# Altium project Chronos.PrjPcb (part 1 of 3)
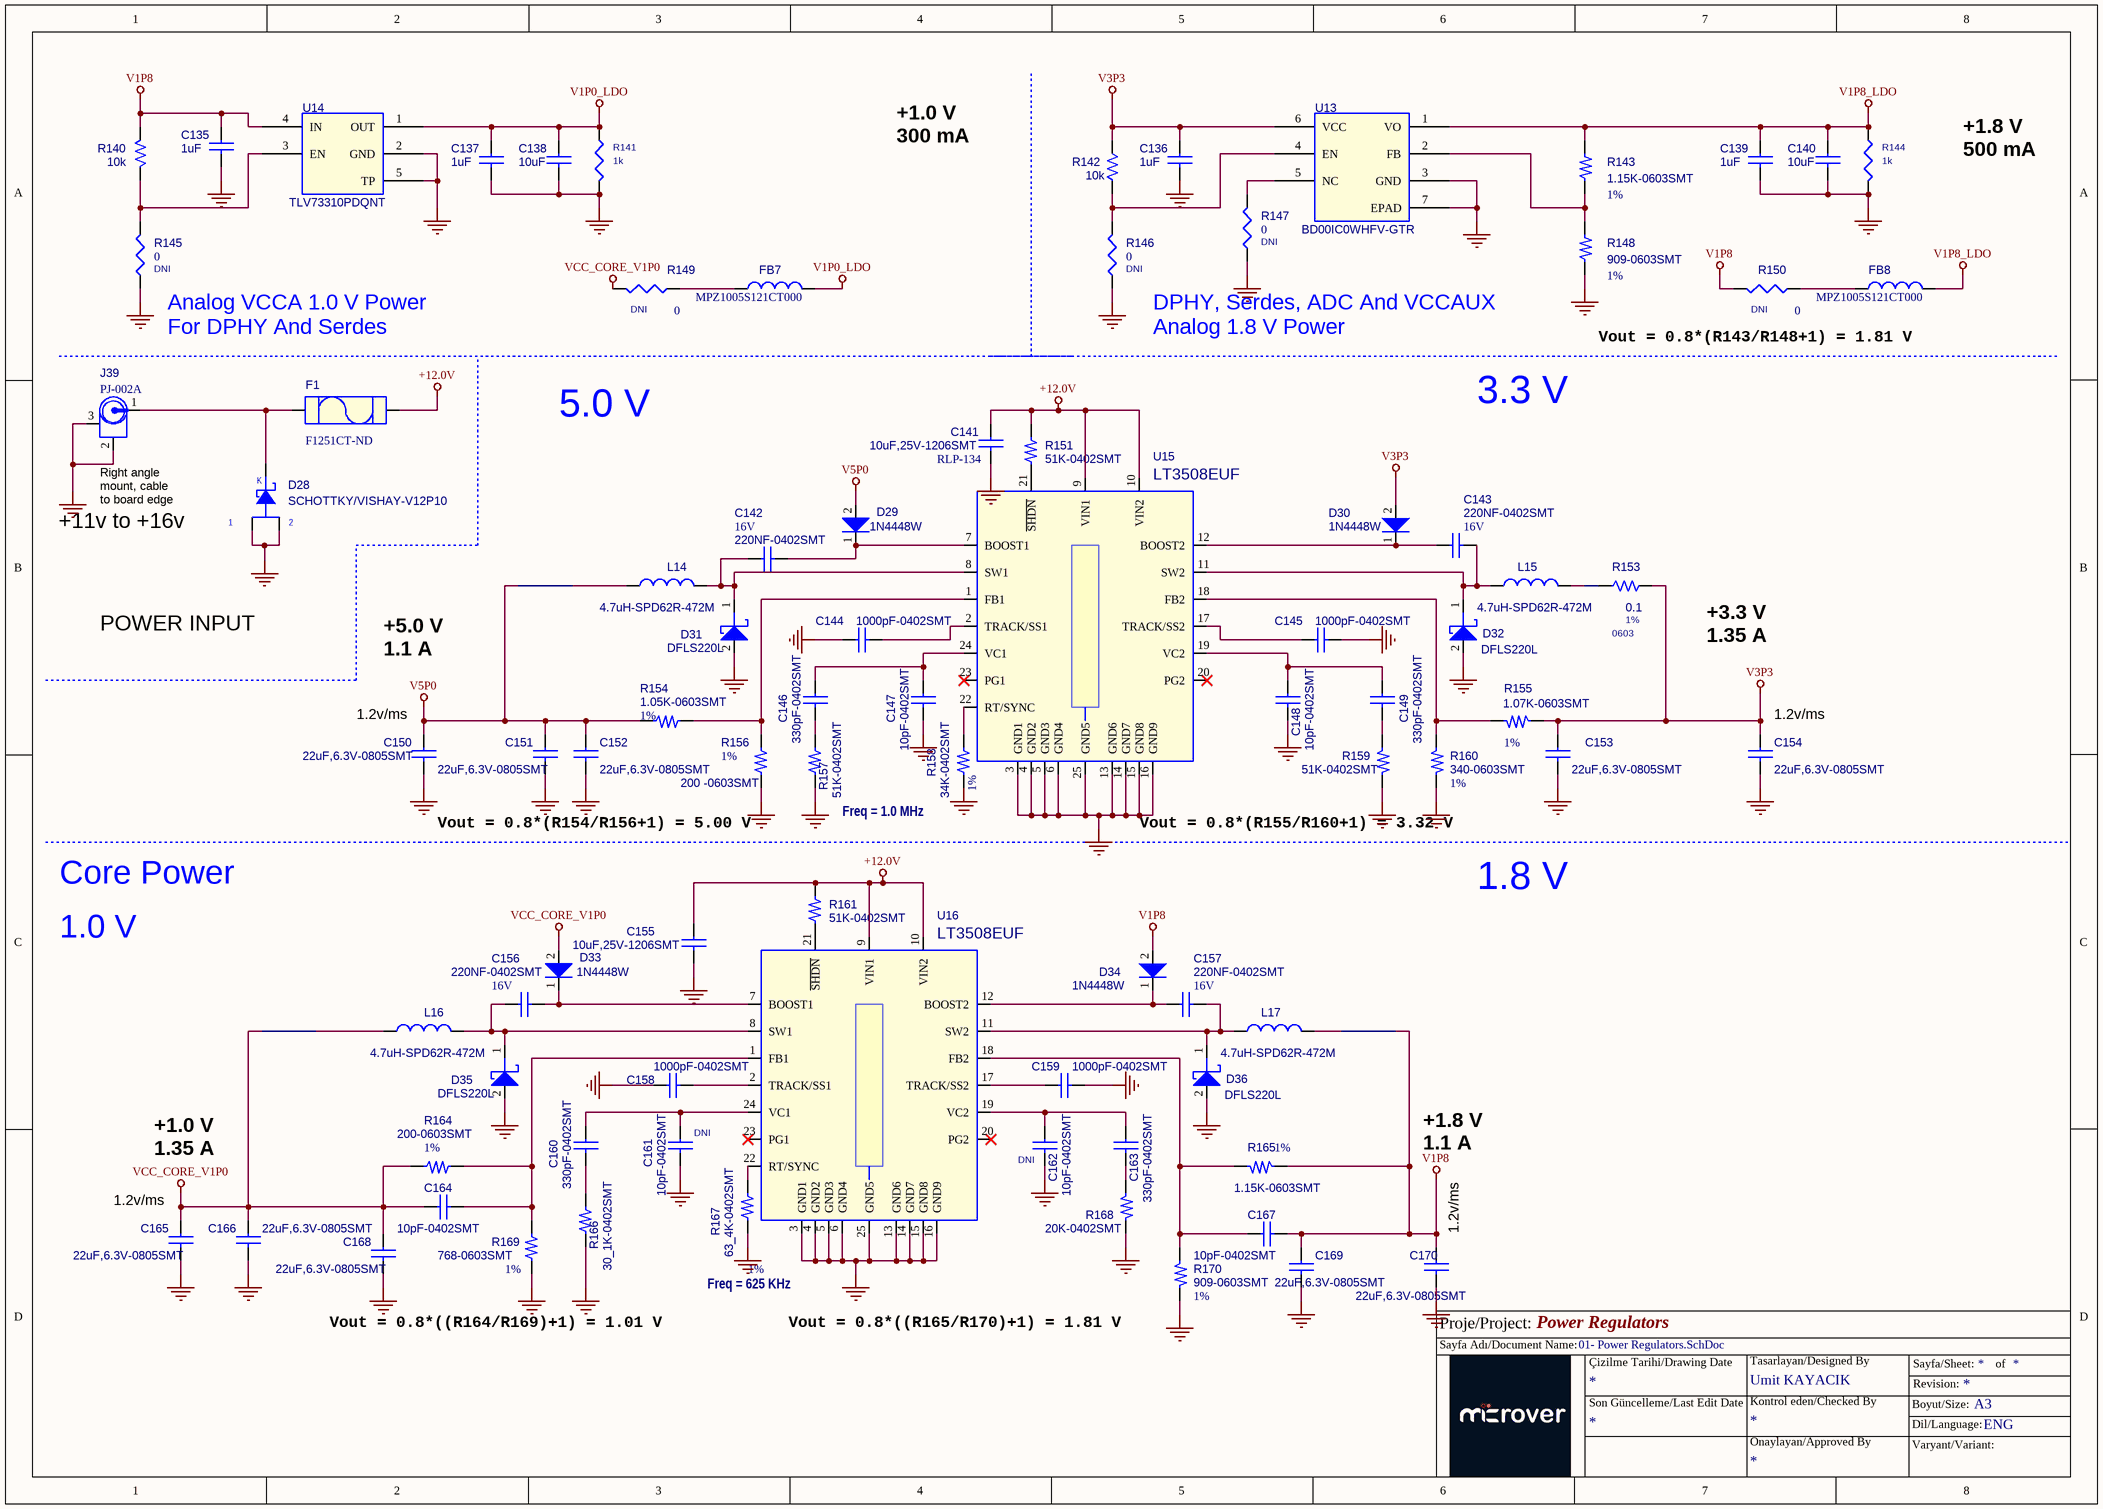
[diagram p0: 01- Power Regulators.SchDoc]
12 sheets, 413 parts. Net scope: global (net labels, ports and power ports of the same name join across sheets).
Board file: Chronos.PcbDoc
Sheets:
  01- Power Regulators.SchDoc
  02 - Power CSI and Bank Power.SchDoc
  03- Power Decoupling.SchDoc
  04 - Camera Interface.SchDoc
  05 - Camera Interface 2.SchDoc
  06 - Soft_DPHY.SchDoc
  07 - USB Interface.SchDoc
  08- Bank2_6_7.SchDoc
  09- I2C, LEDs And Push Button.SchDoc
  10 - Configuration And ADC.SchDoc
  11- IMU.SchDoc
  12 - JETSON_CON.SchDoc

## Sheet 01- Power Regulators.SchDoc: Power Regulators
size A3; Page Number: 1; Page Size: B; Page Count: 12; Board Rev: B; Project Name: CrossLink-NX Evaluation Board; RevCode: 1.0; Doc: 305-PD-19-0819; DsnPath: C:\Users\HAltinkilit\Downloads\Crosslink-NX-Design-Files\CrossLink-NX-Eval-Brd-Schematic-RevB-191122.DSN; SchematicName: SCHEMATIC1; PageName: 13 - Power Regulators; PageSize: B; TopSchematic: True

### Parts
C135  1uF  [C0603]
C136  1uF  [C0603]
C137  1uF  [C0603]
C138  10uF  [C0603]
C139  1uF  [C0603]
C140  10uF  [C0603]
C141  10uF,25V-1206SMT  [RLP-134]
C142  220NF-0402SMT  COMPFIXED: 16V  [RLP-130-A]
C143  220NF-0402SMT  COMPFIXED: 16V  [RLP-130-A]
C144  1000pF-0402SMT  [RLP-130-A]
C145  1000pF-0402SMT  [RLP-130-A]
C146  330pF-0402SMT  [RLP-130-A]
C147  10pF-0402SMT  [RLP-130-A]
C148  10pF-0402SMT  [RLP-130-A]
C149  330pF-0402SMT  [RLP-130-A]
C150  22uF,6.3V-0805SMT  [RLP-133]
C151  22uF,6.3V-0805SMT  [RLP-133]
C152  22uF,6.3V-0805SMT  [RLP-133]
C153  22uF,6.3V-0805SMT  [RLP-133]
C154  22uF,6.3V-0805SMT  [RLP-133]
C155  10uF,25V-1206SMT  [RLP-134]
C156  220NF-0402SMT  COMPFIXED: 16V  [RLP-130-A]
C157  220NF-0402SMT  COMPFIXED: 16V  [RLP-130-A]
C158  1000pF-0402SMT  [RLP-130-A]
C159  1000pF-0402SMT  [RLP-130-A]
C160  330pF-0402SMT  [RLP-130-A]
C161  10pF-0402SMT  Populate: DNI  [RLP-130-A]
C162  10pF-0402SMT  Populate: DNI  [RLP-130-A]
C163  330pF-0402SMT  [RLP-130-A]
C164  10pF-0402SMT  [RLP-130-A]
C165  22uF,6.3V-0805SMT  [RLP-133]
C166  22uF,6.3V-0805SMT  [RLP-133]
C167  10pF-0402SMT  [RLP-130-A]
C168  22uF,6.3V-0805SMT  [RLP-133]
C169  22uF,6.3V-0805SMT  [RLP-133]
C170  22uF,6.3V-0805SMT  [RLP-133]
D28  SCHOTTKY/VISHAY-V12P10  [V12P10]
D29  1N4448W  [1N4448W]
D30  1N4448W  [1N4448W]
D31  DFLS220L  [DFLS220L]
D32  DFLS220L  [DFLS220L]
D33  1N4448W  [1N4448W]
D34  1N4448W  [1N4448W]
D35  DFLS220L  [DFLS220L]
D36  DFLS220L  [DFLS220L]
F1  F1251CT-ND  [0154010]
FB7  MPZ1005S121CT000  [FB0402]
FB8  MPZ1005S121CT000  [FB0402]
J39  PJ-002A  [pj_002a_3p]
L14  4.7uH-SPD62R-472M  [SPD62R]
L15  4.7uH-SPD62R-472M  [SPD62R]
L16  4.7uH-SPD62R-472M  [SPD62R]
L17  4.7uH-SPD62R-472M  [SPD62R]
R140  10k  [R0402]
R141  1k  [R0402]
R142  10k  [R0402]
R143  1.15K-0603SMT  COMPFIXED: 1%  [RLP-101]
R144  1k  [R0402]
R145  0  Assy: DNI  [R0402]
R146  0  Assy: DNI  [R0603]
R147  0  Assy: DNI  [R0603]
R148  909-0603SMT  COMPFIXED: 1%  [RLP-101]
R149  0  Assy: DNI  [R0603]
R150  0  Assy: DNI  [R0603]
R151  51K-0402SMT  [RLP-100]
R153  0.1  Tollerance: 1%  [0603]
R154  1.05K-0603SMT  COMPFIXED: 1%  [RLP-101]
R155  1.07K-0603SMT  COMPFIXED: 1%  [RLP-101]
R156  200 -0603SMT  COMPFIXED: 1%  [RLP-101]
R157  51K-0402SMT  [RLP-100]
R158  34K-0402SMT  COMPGROUP: Freq = 1.0 MHz  COMPFIXED: 1%  [RLP-100]
R159  51K-0402SMT  [RLP-100]
R160  340-0603SMT  COMPFIXED: 1%  [RLP-101]
R161  51K-0402SMT  [RLP-100]
R164  200-0603SMT  COMPFIXED: 1%  [RLP-101]
R165  1.15K-0603SMT  COMPFIXED: 1%  [RLP-101]
R166  30_1K-0402SMT  [RLP-100]
R167  63_4K-0402SMT  COMPGROUP: Freq = 625 KHz  COMPFIXED: 1%  [RLP-100]
R168  20K-0402SMT  [RLP-100]
R169  768-0603SMT  COMPFIXED: 1%  [RLP-101]
R170  909-0603SMT  COMPFIXED: 1%  [RLP-101]
U13  BD00IC0WHFV-GTR  [6HVSOF_BD00IC0WHFV]
U14  TLV73310PDQNT  [4X2SON]
U15  LT3508EUF  [LT3508EUF]
U16  LT3508EUF  [LT3508EUF]

### Nets
+12.0V: C141.1 C155.1 F1.2 R151.1 R161.1 U15.9(VIN1) U15.10(VIN2) U16.9(VIN1) U16.10(VIN2)
GND: C135.2 C136.2 C137.2 C138.2 C139.2 C140.2 C141.2 C144.1 C145.2 C147.2 C148.2 C150.2 C151.2 C152.2 C153.2 C154.2 C155.2 C158.1 C159.2 C161.2 C162.2 C165.2 C166.2 C168.2 C169.2 C170.2 D28.1(Anode1) D28.2(Anode2) D31.2 D32.2 D35.2 D36.2 J39.2(GND) J39.3(GND) R141.2 R144.2 R145.2 R146.2 R147.2 R148.1 R156.2 R157.2 R158.2 R159.2 R160.2 R166.2 R167.2 R168.2 R169.2 R170.2 U13.3(GND) U13.7(EPAD) U14.2(GND) U14.5(TP) U15.3(GND1) U15.4(GND2) U15.5(GND3) U15.6(GND4) U15.13(GND6) U15.14(GND7) U15.15(GND8) U15.16(GND9) U15.25(GND5) U16.3(GND1) U16.4(GND2) U16.5(GND3) U16.6(GND4) U16.13(GND6) U16.14(GND7) U16.15(GND8) U16.16(GND9) U16.25(GND5)
V1P0_LDO: C137.1 C138.1 FB7.2 R141.1 U14.1(OUT)
V1P8: C135.1 C167.2 C169.1 C170.1 D34.2 L17.1 R140.2 R150.2 R165.1 U14.4(IN)
V1P8_LDO: C139.1 C140.1 FB8.2 R143.2 R144.1 U13.1(VO)
V3P3: C136.1 C153.1 C154.1 D30.2 R142.2 R153.2 R155.1 U13.6(VCC)
V5P0: C150.1 C151.1 C152.1 D29.2 L14.1 R154.1
VCC_CORE_V1P0: C164.1 C165.1 C166.1 C168.1 D33.2 L16.1 R149.2 R164.1
NetC142_1: C142.1 D31.1 L14.2 U15.8(SW1)
NetC142_2: C142.2 D29.1 U15.7(BOOST1)
NetC143_1: C143.1 D30.1 U15.12(BOOST2)
NetC143_2: C143.2 D32.1 L15.2 U15.11(SW2)
NetC144_2: C144.2 U15.2(TRACK/SS1)
NetC145_1: C145.1 U15.17(TRACK/SS2)
NetC146_1: C146.1 C147.1 U15.24(VC1)
NetC146_2: C146.2 R157.1
NetC148_1: C148.1 C149.1 U15.19(VC2)
NetC149_2: C149.2 R159.1
NetC156_1: C156.1 D35.1 L16.2 U16.8(SW1)
NetC156_2: C156.2 D33.1 U16.7(BOOST1)
NetC157_1: C157.1 D34.1 U16.12(BOOST2)
NetC157_2: C157.2 D36.1 L17.2 U16.11(SW2)
NetC158_2: C158.2 U16.2(TRACK/SS1)
NetC159_1: C159.1 U16.17(TRACK/SS2)
NetC160_1: C160.1 C161.1 U16.24(VC1)
NetC160_2: C160.2 R166.1
NetC162_1: C162.1 C163.1 U16.19(VC2)
NetC163_2: C163.2 R168.1
NetC164_2: C164.2 R164.2 R169.1 U16.1(FB1)
NetC167_1: C167.1 R165.2 R170.1 U16.18(FB2)
NetD28_3: D28.3(K) F1.1 J39.1(+5V)
NetFB7_1: FB7.1 R149.1
NetFB8_1: FB8.1 R150.1
NetL15_1: L15.1 R153.1
NetR140_1: R140.1 R145.1 U14.3(EN)
NetR142_1: R142.1 R146.1 U13.4(EN)
NetR143_1: R143.1 R148.2 U13.2(FB)
NetR147_1: R147.1 U13.5(NC)
NetR151_2: R151.2 U15.21(~{SHDN})
NetR154_2: R154.2 R156.1 U15.1(FB1)
NetR155_2: R155.2 R160.1 U15.18(FB2)
NetR158_1: R158.1 U15.22(RT/SYNC)
NetR161_2: R161.2 U16.21(~{SHDN})
NetR167_1: R167.1 U16.22(RT/SYNC)

Not connected (* = marked no-connect by the designer): U15 20(PG2)* 23(PG1)*; U16 20(PG2)* 23(PG1)*

### Notes on the sheet
- +1.0 V
  300 mA
- +1.8 V
  500 mA
- (near R145) Analog VCCA 1.0 V Power
  For DPHY And Serdes
- DPHY, Serdes, ADC And VCCAUX
  Analog 1.8 V Power
- Vout = 0.8*(R143/R148+1) = 1.81 V
- 5.0 V
- 3.3 V
- (near J39) Right angle
  mount, cable
  to board edge
- (near D28) K
- +11v to +16v
- (near D28) 1
- (near D28) 2
- POWER INPUT
- +5.0 V
  1.1 A
- +3.3 V
  1.35 A
- (near C150) 1.2v/ms
- (near C154) 1.2v/ms
- Vout = 0.8*(R154/R156+1) = 5.00 V
- Vout = 0.8*(R155/R160+1) = 3.32 V
- Core Power
- 1.8 V
- 1.0 V
- +1.0 V
  1.35 A
- +1.8 V
  1.1 A
- (near C165) 1.2v/ms
- (near C170) 1.2v/ms
- Vout = 0.8*((R164/R169)+1) = 1.01 V
- Vout = 0.8*((R165/R170)+1) = 1.81 V
- Proje/Project:
- Sayfa Adı/Document Name:
- Çizilme Tarihi/Drawing Date
- Umit KAYACIK
- Tasarlayan/Designed By
- Sayfa/Sheet:
- Revision:
- of
- Son Güncelleme/Last Edit Date
- Kontrol eden/Checked By
- Onaylayan/Approved By
- Boyut/Size:
- Varyant/Variant:
- Dil/Language:
- A3
- ENG

### Library data of the parts
C135 = CAP NP: CAP CER 10UF 10V 20% X6S 0603; Part Reference: C135; Manufacturer Part Number: CL10X106MP8NRNC; Manufacturer: Samsung; Value: 1uF; MFG P/N: CL10X106MP8NRNC; Man. Part #: CL10X106MP8NRNC; MFG: Samsung; Assy: -; PCB Footprint: C0603
C136 = CAP NP: CAP CER 10UF 10V 20% X6S 0603; Part Reference: C136; Manufacturer Part Number: CL10X106MP8NRNC; Manufacturer: Samsung; Value: 1uF; MFG P/N: CL10X106MP8NRNC; Man. Part #: CL10X106MP8NRNC; MFG: Samsung; Assy: -; PCB Footprint: C0603
C137 = CAP NP: CAP CER 10UF 10V 20% X6S 0603; Part Reference: C137; Manufacturer Part Number: CL10X106MP8NRNC; Manufacturer: Samsung; Value: 1uF; Assy: -; MFG P/N: CL10X106MP8NRNC; Man. Part #: CL10X106MP8NRNC; MFG: Samsung; PCB Footprint: C0603
C138 = CAP NP: CAP CER 10UF 10V 20% X6S 0603; Part Reference: C138; Man. Part #: CL10X106MP8NRNC; MFG: Samsung; Value: 10uF; Assy: -; Manufacturer: Samsung; MFG P/N: CL10X106MP8NRNC; Manufacturer Part Number: CL10X106MP8NRNC; PCB Footprint: C0603
C139 = CAP NP: CAP CER 10UF 10V 20% X6S 0603; Part Reference: C139; Man. Part #: CL10X106MP8NRNC; MFG: Samsung; Value: 1uF; Assy: -; Manufacturer: Samsung; MFG P/N: CL10X106MP8NRNC; Manufacturer Part Number: CL10X106MP8NRNC; PCB Footprint: C0603
C140 = CAP NP: CAP CER 10UF 10V 20% X6S 0603; Part Reference: C140; Man. Part #: CL10X106MP8NRNC; MFG: Samsung; Value: 10uF; Assy: -; Manufacturer: Samsung; MFG P/N: CL10X106MP8NRNC; Manufacturer Part Number: CL10X106MP8NRNC; PCB Footprint: C0603
C141 = CAP-NP: Part Reference: C141; Value: 10uF,25V-1206SMT; Assy: -; PCB Footprint: RLP-134
C142 = CAP-NP: Part Reference: C142; Value: 220NF-0402SMT; Assy: -; PCB Footprint: RLP-130-A
C143 = CAP-NP: Part Reference: C143; Value: 220NF-0402SMT; Assy: -; PCB Footprint: RLP-130-A
C144 = CAP-NP: Part Reference: C144; Value: 1000pF-0402SMT; Assy: -; PCB Footprint: RLP-130-A
C145 = CAP-NP: Part Reference: C145; Value: 1000pF-0402SMT; Assy: -; PCB Footprint: RLP-130-A
C146 = CAP-NP: Part Reference: C146; Value: 330pF-0402SMT; Assy: -; PCB Footprint: RLP-130-A
C147 = CAP-NP: Part Reference: C147; Value: 10pF-0402SMT; Assy: -; PCB Footprint: RLP-130-A
C148 = CAP-NP: Part Reference: C148; Value: 10pF-0402SMT; Assy: -; PCB Footprint: RLP-130-A
C149 = CAP-NP: Part Reference: C149; Value: 330pF-0402SMT; Assy: -; PCB Footprint: RLP-130-A
C150 = CAP-NP: CAP CER 22UF 10V X5R 0805; Part Reference: C150; Manufacturer: Samsung; Manufacturer Part Number: CL21A226KPCLRNC; Value: 22uF,6.3V-0805SMT; Assy: -; PCB Footprint: RLP-133
C151 = CAP-NP: CAP CER 22UF 10V X5R 0805; Part Reference: C151; Manufacturer: Samsung; Manufacturer Part Number: CL21A226KPCLRNC; Value: 22uF,6.3V-0805SMT; Assy: -; PCB Footprint: RLP-133
C152 = CAP-NP: CAP CER 22UF 10V X5R 0805; Part Reference: C152; Manufacturer: Samsung; Manufacturer Part Number: CL21A226KPCLRNC; Value: 22uF,6.3V-0805SMT; Assy: -; PCB Footprint: RLP-133
C153 = CAP-NP: CAP CER 22UF 10V X5R 0805; Part Reference: C153; Manufacturer Part Number: CL21A226KPCLRNC; Manufacturer: Samsung; Value: 22uF,6.3V-0805SMT; Assy: -; PCB Footprint: RLP-133
C154 = CAP-NP: CAP CER 22UF 10V X5R 0805; Part Reference: C154; Manufacturer Part Number: CL21A226KPCLRNC; Manufacturer: Samsung; Value: 22uF,6.3V-0805SMT; Assy: -; PCB Footprint: RLP-133
C155 = CAP-NP: Part Reference: C155; Value: 10uF,25V-1206SMT; Assy: -; PCB Footprint: RLP-134
C156 = CAP-NP: Part Reference: C156; Value: 220NF-0402SMT; Assy: -; PCB Footprint: RLP-130-A
C157 = CAP-NP: Part Reference: C157; Value: 220NF-0402SMT; Assy: -; PCB Footprint: RLP-130-A
C158 = CAP-NP: Part Reference: C158; Value: 1000pF-0402SMT; Assy: -; PCB Footprint: RLP-130-A
C159 = CAP-NP: Part Reference: C159; Value: 1000pF-0402SMT; Assy: -; PCB Footprint: RLP-130-A
C160 = CAP-NP: Part Reference: C160; Value: 330pF-0402SMT; Assy: -; PCB Footprint: RLP-130-A
C161 = CAP-NP: Part Reference: C161; ASSY: DNI; Value: 10pF-0402SMT; PCB Footprint: RLP-130-A
C162 = CAP-NP: Part Reference: C162; ASSY: DNI; Value: 10pF-0402SMT; PCB Footprint: RLP-130-A
C163 = CAP-NP: Part Reference: C163; Value: 330pF-0402SMT; Assy: -; PCB Footprint: RLP-130-A
C164 = CAP-NP: Part Reference: C164; Value: 10pF-0402SMT; Assy: -; PCB Footprint: RLP-130-A
C165 = CAP-NP: CAP CER 22UF 10V X5R 0805; Part Reference: C165; Manufacturer Part Number: CL21A226KPCLRNC; Manufacturer: Samsung; Value: 22uF,6.3V-0805SMT; Assy: -; PCB Footprint: RLP-133
C166 = CAP-NP: CAP CER 22UF 10V X5R 0805; Part Reference: C166; Manufacturer: Samsung; Manufacturer Part Number: CL21A226KPCLRNC; Value: 22uF,6.3V-0805SMT; Assy: -; PCB Footprint: RLP-133
C167 = CAP-NP: Part Reference: C167; Value: 10pF-0402SMT; Assy: -; PCB Footprint: RLP-130-A
C168 = CAP-NP: CAP CER 22UF 10V X5R 0805; Part Reference: C168; Manufacturer: Samsung; Manufacturer Part Number: CL21A226KPCLRNC; Value: 22uF,6.3V-0805SMT; Assy: -; PCB Footprint: RLP-133
C169 = CAP-NP: CAP CER 22UF 10V X5R 0805; Part Reference: C169; Manufacturer Part Number: CL21A226KPCLRNC; Manufacturer: Samsung; Value: 22uF,6.3V-0805SMT; Assy: -; PCB Footprint: RLP-133
C170 = CAP-NP: CAP CER 22UF 10V X5R 0805; Part Reference: C170; Manufacturer: Samsung; Manufacturer Part Number: CL21A226KPCLRNC; Value: 22uF,6.3V-0805SMT; Assy: -; PCB Footprint: RLP-133
D28 = DIODE SCHOTTKY21: Part Reference: D28; Value: SCHOTTKY/VISHAY-V12P10; Assy: -; PCB Footprint: V12P10
D29 = DIODE_0: Part Reference: D29; Value: 1N4448W; Assy: -; PCB Footprint: 1N4448W
D30 = DIODE_0: Part Reference: D30; Value: 1N4448W; Assy: -; PCB Footprint: 1N4448W
D31 = D-SCHOTTKY_0: Part Reference: D31; Value: DFLS220L; Assy: -; PCB Footprint: DFLS220L
D32 = D-SCHOTTKY_0: Part Reference: D32; Value: DFLS220L; Assy: -; PCB Footprint: DFLS220L
D33 = DIODE_0: Part Reference: D33; Value: 1N4448W; Assy: -; PCB Footprint: 1N4448W
D34 = DIODE_0: Part Reference: D34; Value: 1N4448W; Assy: -; PCB Footprint: 1N4448W
D35 = D-SCHOTTKY_0: Part Reference: D35; Value: DFLS220L; Assy: -; PCB Footprint: DFLS220L
D36 = D-SCHOTTKY_0: Part Reference: D36; Value: DFLS220L; Assy: -; PCB Footprint: DFLS220L
F1 = SMTFUSE_0: 5A Fast-Blo SMT Socketed Fuse; Part Reference: F1; Value: F1251CT-ND; Assy: -; PCB Footprint: 0154010
FB7 = INDUCTOR_1: FERRITE BEAD 120 OHM 0402 1LN; Part Reference: FB7; Manufacturer: TDK Corporation; Value: MPZ1005S121CT000; Assy: -; PCB Footprint: FB0402; Manufacturer Part Number: MPZ1005S121CT000
FB8 = INDUCTOR_1: FERRITE BEAD 120 OHM 0402 1LN; Part Reference: FB8; Manufacturer: TDK Corporation; Value: MPZ1005S121CT000; Assy: -; PCB Footprint: FB0402; Manufacturer Part Number: MPZ1005S121CT000
J39 = 22HP037A: Male Power Jack 2.1mm; Part Reference: J39; Value: PJ-002A; Assy: -; PCB Footprint: pj_002a_3p
L14 = IND: Part Reference: L14; COMPGROUP: CDRH3D18; COMPFIXED: SUMIDA; Value: 4.7uH-SPD62R-472M; Assy: -; PCB Footprint: SPD62R
L15 = IND: Part Reference: L15; COMPFIXED: SUMIDA; COMPGROUP: CDRH3D18C; Value: 4.7uH-SPD62R-472M; Assy: -; PCB Footprint: SPD62R
L16 = IND: Part Reference: L16; COMPFIXED: SUMIDA; COMPGROUP: CDRH3D18; Value: 4.7uH-SPD62R-472M; Assy: -; PCB Footprint: SPD62R
L17 = IND: Part Reference: L17; COMPFIXED: SUMIDA; COMPGROUP: CDRH3D18C; Value: 4.7uH-SPD62R-472M; Assy: -; PCB Footprint: SPD62R
R140 = R_Dup2: RES SMD 4.7K OHM 5% 1/10W 0402; Part Reference: R140; Manufacturer Part Number: ERJ-2GEJ472X; DIST: FLAT; PSpiceTemplate: R^@REFDES %1 %2 ?TOLERANCE|R^@REFDES| @VALUE  ?TOLERANCE|\n.model R^@REFDES RES R=1 DEV=@TOLERANCE%|; VOLTAGE: RVMAX; SLOPE: RSMAX; MAX_TEMP: RTMAX; POWER: RMAX; COMPHEIGHT: 0.000; MEMORY: NO; COMPGROUP: 0; COMPROT: 180; COMPLOC: [970.000,1160.000]; COMPSIDE: TOP; FPLIST: AX/RC05,SM/R_0603; MFG: Panasonic; Value: 10k; DECOUPLER: NO; COMPKEY: NO; COMPLOCKED: NO; COMPFIXED: NO; Manufacturer: Panasonic; MFG P/N: ERJ-2GEJ472X; Assy: -; PCB Footprint: R0402
R141 = RES_1K_1W16_0402_5P: RES SMD 1K OHM 1% 1/10W 0402; Part Reference: R141; Manufacturer Part Number: ERJ-2RKF1001X; Manufacturer: Panasonic; Unit Price (USD): 0.02; Total Area(sq-mm): 0.5; Wattage: 1/16W; DIST: FLAT; MAX_TEMP: RTMAX; MFG P/N: RMCF0402JT1K00; MFG: Stackpole Electronics Inc; TC1: 0; Length(mm): 1; Width(mm): 0.5; TC2: 0; Value: 1k; Assy: -; PCB Footprint: R0402; Reference: R141
R142 = R_Dup2: RES SMD 4.7K OHM 5% 1/10W 0402; Part Reference: R142; Manufacturer: Panasonic; DIST: FLAT; PSpiceTemplate: R^@REFDES %1 %2 ?TOLERANCE|R^@REFDES| @VALUE  ?TOLERANCE|\n.model R^@REFDES RES R=1 DEV=@TOLERANCE%|; VOLTAGE: RVMAX; SLOPE: RSMAX; MAX_TEMP: RTMAX; POWER: RMAX; MFG P/N: ERJ-2GEJ472X; FPLIST: AX/RC05,SM/R_0603; COMPSIDE: TOP; COMPLOC: [970.000,1160.000]; COMPROT: 180; COMPGROUP: 0; COMPFIXED: NO; COMPHEIGHT: 0.000; Value: 10k; MFG: Panasonic; Manufacturer Part Number: ERJ-2GEJ472X; COMPLOCKED: NO; COMPKEY: NO; DECOUPLER: NO; MEMORY: NO; Assy: -; PCB Footprint: R0402
R143 = R_Dup1: Part Reference: R143; Value: 1.15K-0603SMT; Assy: -; PCB Footprint: RLP-101
R144 = RES_1K_1W16_0402_5P: RES SMD 1K OHM 1% 1/10W 0402; Part Reference: R144; Manufacturer Part Number: ERJ-2RKF1001X; Manufacturer: Panasonic; Unit Price (USD): 0.02; Total Area(sq-mm): 0.5; Wattage: 1/16W; DIST: FLAT; MAX_TEMP: RTMAX; MFG P/N: RMCF0402JT1K00; MFG: Stackpole Electronics Inc; TC1: 0; Length(mm): 1; Width(mm): 0.5; TC2: 0; Value: 1k; Assy: -; PCB Footprint: R0402; Reference: R144
R145 = 0R_0603: RES 0.0 OHM 1/10W JUMP 0402 SMD; Manufacturer: Yageo; Manufacturer Part Number: RC0603JR-070RL; Part Reference: R145; Class: Discrete; PCB Footprint: R0603; Digikey P/N: 311-0.0GRTR-ND; Value: 0
R146 = 0R_0603: RES 0.0 OHM 1/10W JUMP 0603 SMD; Manufacturer: Yageo; Manufacturer Part Number: RC0603JR-070RL; Part Reference: R146; Class: Discrete; Digikey P/N: 311-0.0GRTR-ND; Value: 0; PCB Footprint: R0603
R147 = 0R_0603: RES 0.0 OHM 1/10W JUMP 0603 SMD; Manufacturer: Yageo; Manufacturer Part Number: RC0603JR-070RL; Part Reference: R147; Class: Discrete; Digikey P/N: 311-0.0GRTR-ND; Value: 0; PCB Footprint: R0603
R148 = R_Dup1: Part Reference: R148; Value: 909-0603SMT; Assy: -; PCB Footprint: RLP-101
R149 = 0R_0603: RES 0.0 OHM 1/10W JUMP 0603 SMD; Manufacturer: Yageo; Manufacturer Part Number: RC0603JR-070RL; Part Reference: R149; Class: Discrete; Digikey P/N: 311-0.0GRTR-ND; Value: 0; PCB Footprint: R0603
R150 = 0R_0603: RES 0.0 OHM 1/10W JUMP 0603 SMD; Manufacturer: Yageo; Manufacturer Part Number: RC0603JR-070RL; Part Reference: R150; Class: Discrete; Digikey P/N: 311-0.0GRTR-ND; Value: 0; PCB Footprint: R0603
R151 = R_Dup1: Part Reference: R151; Value: 51K-0402SMT; Assy: -; PCB Footprint: RLP-100
R153 = R_Dup2: Part Reference: R153; DIST: FLAT; PSpiceTemplate: R^@REFDES %1 %2 ?TOLERANCE|R^@REFDES| @VALUE  ?TOLERANCE|\n.model R^@REFDES RES R=1 DEV=@TOLERANCE%|; VOLTAGE: RVMAX; SLOPE: RSMAX; MAX_TEMP: RTMAX; POWER: RMAX; FPLIST: AX/RC05,SM/R_0603; COMPSIDE: TOP; COMPLOC: [970.000,1160.000]; COMPROT: 180; COMPGROUP: 0; COMPFIXED: NO; COMPHEIGHT: 0.000; Value: 0.1; Assy: -; COMPLOCKED: NO; COMPKEY: NO; DECOUPLER: NO; MEMORY: NO; PCB Footprint: 0603
R154 = R_Dup1: Part Reference: R154; Value: 1.05K-0603SMT; Assy: -; PCB Footprint: RLP-101
R155 = R_Dup1: Part Reference: R155; Value: 1.07K-0603SMT; Assy: -; PCB Footprint: RLP-101
R156 = R_Dup1: Part Reference: R156; Value: 200 -0603SMT; Assy: -; PCB Footprint: RLP-101
R157 = R_Dup1: Part Reference: R157; COMPFIXED: 1%; Value: 51K-0402SMT; Assy: -; PCB Footprint: RLP-100
R158 = R_Dup1: Part Reference: R158; Value: 34K-0402SMT; Assy: -; PCB Footprint: RLP-100
R159 = R_Dup1: Part Reference: R159; COMPFIXED: 1%; Value: 51K-0402SMT; Assy: -; PCB Footprint: RLP-100
R160 = R_Dup1: Part Reference: R160; Value: 340-0603SMT; Assy: -; PCB Footprint: RLP-101
R161 = R_Dup1: Part Reference: R161; Value: 51K-0402SMT; Assy: -; PCB Footprint: RLP-100
R164 = R_Dup1: Part Reference: R164; Value: 200-0603SMT; Assy: -; PCB Footprint: RLP-101
R165 = R_Dup1: Part Reference: R165; Value: 1.15K-0603SMT; Assy: -; PCB Footprint: RLP-101
R166 = R_Dup1: Part Reference: R166; COMPFIXED: 1%; Value: 30_1K-0402SMT; Assy: -; PCB Footprint: RLP-100
R167 = R_Dup1: Part Reference: R167; Value: 63_4K-0402SMT; Assy: -; PCB Footprint: RLP-100
R168 = R_Dup1: Part Reference: R168; COMPFIXED: 1%; Value: 20K-0402SMT; Assy: -; PCB Footprint: RLP-100
R169 = R_Dup1: Part Reference: R169; Value: 768-0603SMT; Assy: -; PCB Footprint: RLP-101
R170 = R_Dup1: Part Reference: R170; Value: 909-0603SMT; Assy: -; PCB Footprint: RLP-101
U13 = BD00IC0WHFV-GTR: Part Reference: U13; Value: BD00IC0WHFV-GTR; Assy: -; PCB Footprint: 6HVSOF_BD00IC0WHFV
U14 = TLV73310PDQNT: Part Reference: U14; Value: TLV73310PDQNT; Assy: -; PCB Footprint: 4X2SON
U15 = LT3508EUF-QFN24UF-4X4_0: Part Reference: U15; UCOST: $0.00; DES: IC, LINEAR TECH, LTC1563; Value: LT3508EUF; Assy: -; PCB Footprint: LT3508EUF
U16 = LT3508EUF-QFN24UF-4X4_0: Part Reference: U16; UCOST: $0.00; DES: IC, LINEAR TECH, LTC1563; Value: LT3508EUF; Assy: -; PCB Footprint: LT3508EUF

## Sheet 02 - Power CSI and Bank Power.SchDoc: Power CSI and Banks
size A3; Page Number: 2; Page Size: B; Page Count: 12; Board Rev: B; Project Name: CrossLink-NX Evaluation Board; RevCode: 1.0; Doc: 305-PD-19-0819; DsnPath: C:\Users\HAltinkilit\Downloads\Crosslink-NX-Design-Files\CrossLink-NX-Eval-Brd-Schematic-RevB-191122.DSN; SchematicName: SCHEMATIC1; PageName: 11 - Power CSI and Bank Power; PageSize: B; TopSchematic: True
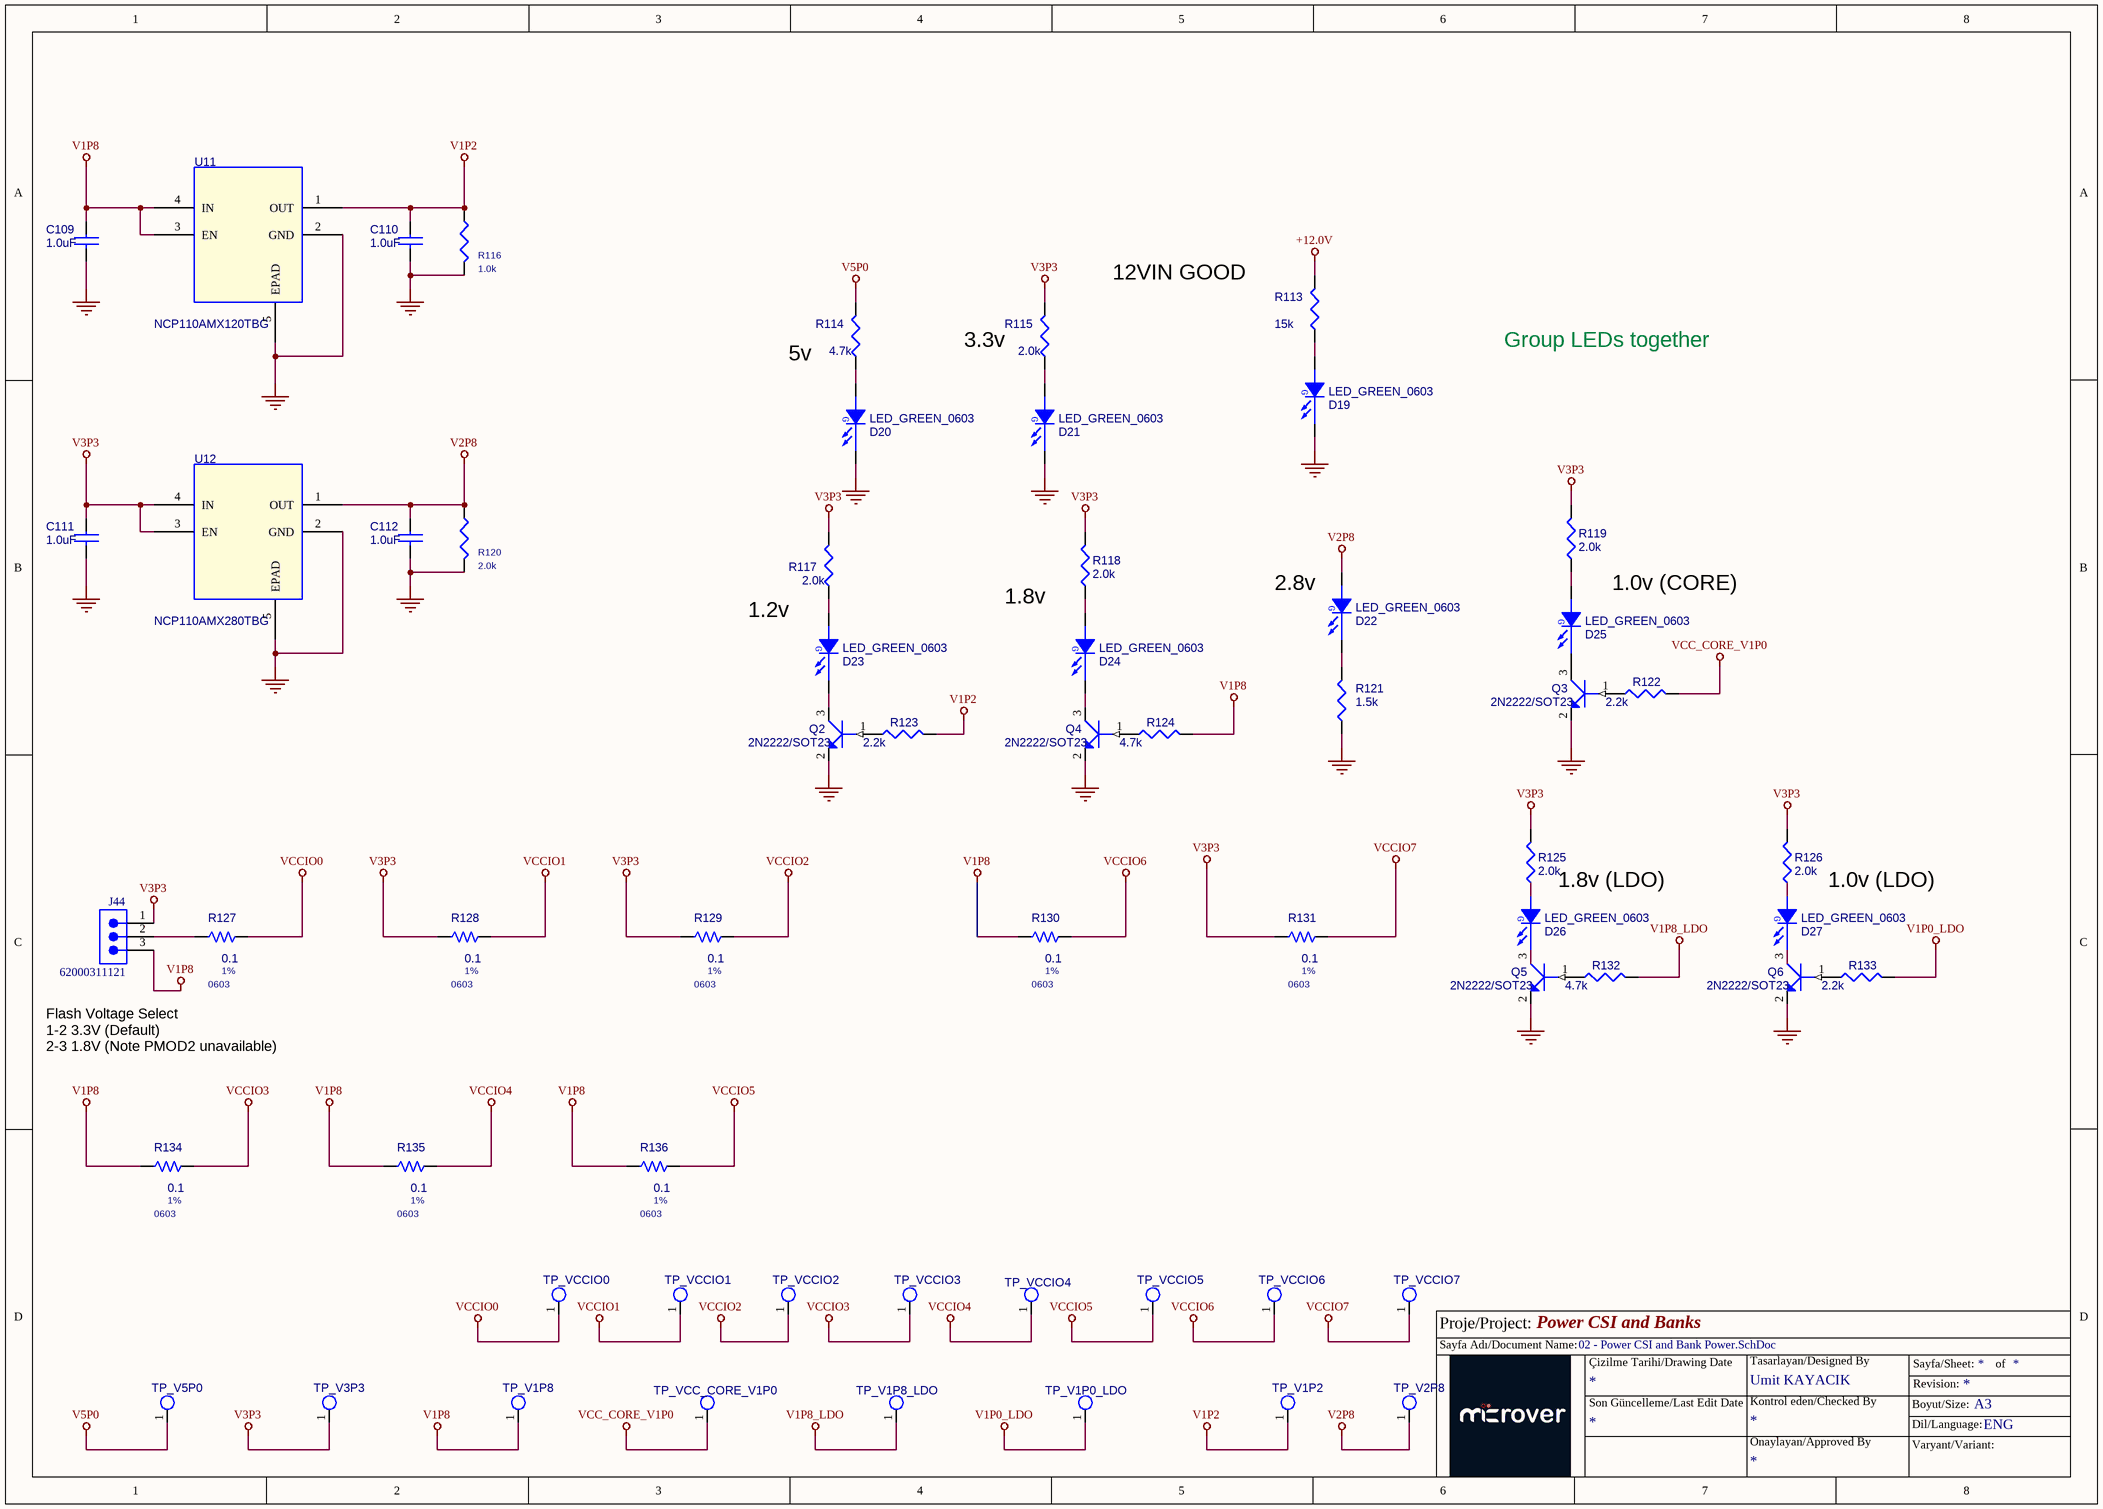
[diagram p1: 02 - Power CSI and Bank Power.SchDoc]

### Parts
C109  1.0uF  [C0603]
C110  1.0uF  [C0603]
C111  1.0uF  [C0603]
C112  1.0uF  [C0603]
D19  LED_GREEN_0603  [APT1608]
D20  LED_GREEN_0603  [APT1608]
D21  LED_GREEN_0603  [APT1608]
D22  LED_GREEN_0603  [APT1608]
D23  LED_GREEN_0603  [APT1608]
D24  LED_GREEN_0603  [APT1608]
D25  LED_GREEN_0603  [APT1608]
D26  LED_GREEN_0603  [APT1608]
D27  LED_GREEN_0603  [APT1608]
J44  62000311121  [62000311121]
Q2  2N2222/SOT23  [MMBT2222ALT-1]
Q3  2N2222/SOT23  [MMBT2222ALT-1]
Q4  2N2222/SOT23  [MMBT2222ALT-1]
Q5  2N2222/SOT23  [MMBT2222ALT-1]
Q6  2N2222/SOT23  [MMBT2222ALT-1]
R113  15k  [RLP-103]
R114  4.7k  [R0402]
R115  2.0k  [R0402]
R116  1.0k  [R0402]
R117  2.0k  [R0402]
R118  2.0k  [R0402]
R119  2.0k  [R0402]
R120  2.0k  [R0402]
R121  1.5k  [R0402]
R122  2.2k  [R0402]
R123  2.2k  [R0402]
R124  4.7k  [R0402]
R125  2.0k  [R0402]
R126  2.0k  [R0402]
R127  0.1  Tollerance: 1%  [0603]
R128  0.1  Tollerance: 1%  [0603]
R129  0.1  Tollerance: 1%  [0603]
R130  0.1  Tollerance: 1%  [0603]
R131  0.1  Tollerance: 1%  [0603]
R132  4.7k  [R0402]
R133  2.2k  [R0402]
R134  0.1  Tollerance: 1%  [0603]
R135  0.1  Tollerance: 1%  [0603]
R136  0.1  Tollerance: 1%  [0603]
TP_V1P0_LDO  TP_S_40_63  [TP_1MM]  (value not drawn)
TP_V1P2  TP_S_40_63  [TP_1MM]  (value not drawn)
TP_V1P8  TP_S_40_63  [TP_1MM]  (value not drawn)
TP_V1P8_LDO  TP_S_40_63  [TP_1MM]  (value not drawn)
TP_V2P8  TP_S_40_63  [TP_1MM]  (value not drawn)
TP_V3P3  TP_S_40_63  [TP_1MM]  (value not drawn)
TP_V5P0  TP_S_40_63  [TP_1MM]  (value not drawn)
TP_VCC_CORE_V1P0  TP_S_40_63  [TP_1MM]  (value not drawn)
TP_VCCIO0  TP_S_40_63  [TP_1MM]  (value not drawn)
TP_VCCIO1  TP_S_40_63  [TP_1MM]  (value not drawn)
TP_VCCIO2  TP_S_40_63  [TP_1MM]  (value not drawn)
TP_VCCIO3  TP_S_40_63  [TP_1MM]  (value not drawn)
TP_VCCIO4  TP_S_40_63  [TP_1MM]  (value not drawn)
TP_VCCIO5  TP_S_40_63  [TP_1MM]  (value not drawn)
TP_VCCIO6  TP_S_40_63  [TP_1MM]  (value not drawn)
TP_VCCIO7  TP_S_40_63  [TP_1MM]  (value not drawn)
U11  NCP110AMX120TBG  [4XDFN_NCP110]
U12  NCP110AMX280TBG  [4XDFN_NCP110]

### Nets
+12.0V: R113.2
GND: C109.2 C110.2 C111.2 C112.2 D19.1(CATHODE) D20.1(CATHODE) D21.1(CATHODE) Q2.2(EMITTER) Q3.2(EMITTER) Q4.2(EMITTER) Q5.2(EMITTER) Q6.2(EMITTER) R116.2 R120.2 R121.1 U11.2(GND) U11.5(EPAD) U12.2(GND) U12.5(EPAD)
V1P0_LDO: R133.2 TP_V1P0_LDO.1(TP)
V1P2: C110.1 R116.1 R123.2 TP_V1P2.1(TP) U11.1(OUT)
V1P8: C109.1 J44.3 R124.2 R130.1 R134.1 R135.1 R136.1 TP_V1P8.1(TP) U11.3(EN) U11.4(IN)
V1P8_LDO: R132.2 TP_V1P8_LDO.1(TP)
V2P8: C112.1 D22.2(ANODE) R120.1 TP_V2P8.1(TP) U12.1(OUT)
V3P3: C111.1 J44.1 R115.2 R117.2 R118.2 R119.2 R125.2 R126.2 R128.1 R129.1 R131.1 TP_V3P3.1(TP) U12.3(EN) U12.4(IN)
V5P0: R114.2 TP_V5P0.1(TP)
VCC_CORE_V1P0: R122.2 TP_VCC_CORE_V1P0.1(TP)
VCCIO0: R127.2 TP_VCCIO0.1(TP)
VCCIO1: R128.2 TP_VCCIO1.1(TP)
VCCIO2: R129.2 TP_VCCIO2.1(TP)
VCCIO3: R134.2 TP_VCCIO3.1(TP)
VCCIO4: R135.2 TP_VCCIO4.1(TP)
VCCIO5: R136.2 TP_VCCIO5.1(TP)
VCCIO6: R130.2 TP_VCCIO6.1(TP)
VCCIO7: R131.2 TP_VCCIO7.1(TP)
NetD19_2: D19.2(ANODE) R113.1
NetD20_2: D20.2(ANODE) R114.1
NetD21_2: D21.2(ANODE) R115.1
NetD22_1: D22.1(CATHODE) R121.2
NetD23_1: D23.1(CATHODE) Q2.3(COLLECTOR)
NetD23_2: D23.2(ANODE) R117.1
NetD24_1: D24.1(CATHODE) Q4.3(COLLECTOR)
NetD24_2: D24.2(ANODE) R118.1
NetD25_1: D25.1(CATHODE) Q3.3(COLLECTOR)
NetD25_2: D25.2(ANODE) R119.1
NetD26_1: D26.1(CATHODE) Q5.3(COLLECTOR)
NetD26_2: D26.2(ANODE) R125.1
NetD27_1: D27.1(CATHODE) Q6.3(COLLECTOR)
NetD27_2: D27.2(ANODE) R126.1
NetJ44_2: J44.2 R127.1
NetQ2_1: Q2.1(BASE) R123.1
NetQ3_1: Q3.1(BASE) R122.1
NetQ4_1: Q4.1(BASE) R124.1
NetQ5_1: Q5.1(BASE) R132.1
NetQ6_1: Q6.1(BASE) R133.1

### Notes on the sheet
- 12VIN GOOD
- 5v
- 3.3v
- Group LEDs together
- 1.2v
- 1.8v
- (near D22) 2.8v
- 1.0v (CORE)
- 1.8v (LDO)
- 1.0v (LDO)
- Flash Voltage Select
  1-2 3.3V (Default)
  2-3 1.8V (Note PMOD2 unavailable)
- Proje/Project:
- Sayfa Adı/Document Name:
- Çizilme Tarihi/Drawing Date
- Umit KAYACIK
- Tasarlayan/Designed By
- Sayfa/Sheet:
- Revision:
- of
- Son Güncelleme/Last Edit Date
- Kontrol eden/Checked By
- Onaylayan/Approved By
- Boyut/Size:
- Varyant/Variant:
- Dil/Language:
- A3
- ENG
- (in symbol LED-SMT1206_GREEN_1) G

### Library data of the parts
C109 = CAP NP: CAP CER 10UF 10V 20% X6S 0603; Part Reference: C109; Manufacturer Part Number: CL10X106MP8NRNC; Manufacturer: Samsung; Value: 1.0uF; Assy: -; MFG P/N: CL10X106MP8NRNC; Man. Part #: CL10X106MP8NRNC; MFG: Samsung; PCB Footprint: C0603
C110 = CAP NP: CAP CER 10UF 10V 20% X6S 0603; Part Reference: C110; Manufacturer Part Number: CL10X106MP8NRNC; Manufacturer: Samsung; Value: 1.0uF; Assy: -; MFG P/N: CL10X106MP8NRNC; Man. Part #: CL10X106MP8NRNC; MFG: Samsung; PCB Footprint: C0603
C111 = CAP NP: CAP CER 10UF 10V 20% X6S 0603; Part Reference: C111; Man. Part #: CL10X106MP8NRNC; MFG: Samsung; Value: 1.0uF; Assy: -; Manufacturer: Samsung; MFG P/N: CL10X106MP8NRNC; Manufacturer Part Number: CL10X106MP8NRNC; PCB Footprint: C0603
C112 = CAP NP: CAP CER 10UF 10V 20% X6S 0603; Part Reference: C112; Man. Part #: CL10X106MP8NRNC; MFG: Samsung; Value: 1.0uF; Assy: -; Manufacturer: Samsung; MFG P/N: CL10X106MP8NRNC; Manufacturer Part Number: CL10X106MP8NRNC; PCB Footprint: C0603
D19 = LED-SMT1206_GREEN_1: Part Reference: D19; Value: LED_GREEN_0603; Assy: -; PCB Footprint: APT1608
D20 = LED-SMT1206_GREEN_1: Part Reference: D20; Value: LED_GREEN_0603; Assy: -; PCB Footprint: APT1608
D21 = LED-SMT1206_GREEN_1: Part Reference: D21; Value: LED_GREEN_0603; Assy: -; PCB Footprint: APT1608
D22 = LED-SMT1206_GREEN_1: Part Reference: D22; Value: LED_GREEN_0603; Assy: -; PCB Footprint: APT1608
D23 = LED-SMT1206_GREEN_1: Part Reference: D23; Value: LED_GREEN_0603; Assy: -; PCB Footprint: APT1608
D24 = LED-SMT1206_GREEN_1: Part Reference: D24; Value: LED_GREEN_0603; Assy: -; PCB Footprint: APT1608
D25 = LED-SMT1206_GREEN_1: Part Reference: D25; Value: LED_GREEN_0603; Assy: -; PCB Footprint: APT1608
D26 = LED-SMT1206_GREEN_1: Part Reference: D26; Value: LED_GREEN_0603; Assy: -; PCB Footprint: APT1608
D27 = LED-SMT1206_GREEN_1: Part Reference: D27; Value: LED_GREEN_0603; Assy: -; PCB Footprint: APT1608
J44 = CMP-1502-00957-5: THT Vertical Pin Header WR-PHD, Pitch 2.00 mm, Single Row, 3 pins; Voltage Rating: 200V; Current Rating: 2A; Gender: Male; Contact Resistance: 20mΩ; Number of Contacts: 3; Min Operating Temperature: -40°C; Max Operating Temperature: 105°C; Height: 6.35mm; Operating Supply Voltage: 200V; Number of Rows: 1; RoHS: Compliant; Number of Pins: 3; Contact Material: Gold; Lead Pitch: 2mm; Orientation: Vertical
Q2 = 2N2222: Part Reference: Q2; Value: 2N2222/SOT23; Assy: -; PCB Footprint: MMBT2222ALT-1
Q3 = 2N2222: Part Reference: Q3; Value: 2N2222/SOT23; Assy: -; PCB Footprint: MMBT2222ALT-1
Q4 = 2N2222: Part Reference: Q4; Value: 2N2222/SOT23; Assy: -; PCB Footprint: MMBT2222ALT-1
Q5 = 2N2222: Part Reference: Q5; Value: 2N2222/SOT23; Assy: -; PCB Footprint: MMBT2222ALT-1
Q6 = 2N2222: Part Reference: Q6; Value: 2N2222/SOT23; Assy: -; PCB Footprint: MMBT2222ALT-1
R113 = RES_0: Part Reference: R113; Value: 15k; Assy: -; PCB Footprint: RLP-103
R114 = RES_0: RES SMD 2.2K OHM 1% 1/10W 0402; Part Reference: R114; Manufacturer Part Number: ERJ-2RKF2201X; Manufacturer: Panasonic; Value: 4.7k; Assy: -; PCB Footprint: R0402
R115 = RES_0: RES SMD 1K OHM 1% 1/10W 0402; Part Reference: R115; Manufacturer: Panasonic; Manufacturer Part Number: ERJ-2RKF1001X; Value: 2.0k; Assy: -; PCB Footprint: R0402
R116 = RES_1K_1W16_0402_5P: RES SMD 1K OHM 1% 1/10W 0402; Part Reference: R116; Manufacturer: Panasonic; Manufacturer Part Number: ERJ-2RKF1001X; Unit Price (USD): 0.02; Total Area(sq-mm): 0.5; Wattage: 1/16W; DIST: FLAT; MAX_TEMP: RTMAX; MFG P/N: RMCF0402JT1K00; MFG: Stackpole Electronics Inc; TC1: 0; Length(mm): 1; Width(mm): 0.5; TC2: 0; Value: 1.0k; Assy: -; PCB Footprint: R0402; Reference: R116
R117 = RES_0: RES SMD 1K OHM 1% 1/10W 0402; Part Reference: R117; Manufacturer Part Number: ERJ-2RKF1001X; Manufacturer: Panasonic; Value: 2.0k; Assy: -; PCB Footprint: R0402
R118 = RES_0: RES SMD 1K OHM 1% 1/10W 0402; Part Reference: R118; Manufacturer Part Number: ERJ-2RKF1001X; Manufacturer: Panasonic; Value: 2.0k; Assy: -; PCB Footprint: R0402
R119 = RES_0: RES SMD 1K OHM 1% 1/10W 0402; Part Reference: R119; Manufacturer Part Number: ERJ-2RKF1001X; Manufacturer: Panasonic; Value: 2.0k; Assy: -; PCB Footprint: R0402
R120 = RES_1K_1W16_0402_5P: RES SMD 1K OHM 1% 1/10W 0402; Part Reference: R120; Manufacturer Part Number: ERJ-2RKF1001X; Manufacturer: Panasonic; Unit Price (USD): 0.02; Total Area(sq-mm): 0.5; Wattage: 1/16W; DIST: FLAT; MAX_TEMP: RTMAX; MFG P/N: RMCF0402JT1K00; MFG: Stackpole Electronics Inc; TC1: 0; Length(mm): 1; Width(mm): 0.5; TC2: 0; Value: 2.0k; Assy: -; PCB Footprint: R0402; Reference: R120
R121 = RES_0: RES SMD 750 OHM 5% 1/10W 0402; Part Reference: R121; Manufacturer: Panasonic; Manufacturer Part Number: ERJ-2GEJ751X; Value: 1.5k; Assy: -; PCB Footprint: R0402
R122 = RES_0: RES SMD 4.7K OHM 5% 1/10W 0402; Part Reference: R122; Manufacturer: Panasonic; MFG P/N: ERJ-2GEJ472X; Value: 2.2k; Assy: -; MFG: Panasonic; Manufacturer Part Number: ERJ-2GEJ472X; PCB Footprint: R0402
R123 = RES_0: RES SMD 4.7K OHM 5% 1/10W 0402; Part Reference: R123; Manufacturer: Panasonic; MFG P/N: ERJ-2GEJ472X; Value: 2.2k; MFG: Panasonic; Manufacturer Part Number: ERJ-2GEJ472X; Assy: -; PCB Footprint: R0402
R124 = RES_0: RES SMD 4.7K OHM 5% 1/10W 0402; Part Reference: R124; Manufacturer: Panasonic; MFG P/N: ERJ-2GEJ472X; Value: 4.7k; MFG: Panasonic; Manufacturer Part Number: ERJ-2GEJ472X; Assy: -; PCB Footprint: R0402
R125 = RES_0: RES SMD 1K OHM 1% 1/10W 0402; Part Reference: R125; Manufacturer: Panasonic; Manufacturer Part Number: ERJ-2RKF1001X; Value: 2.0k; Assy: -; PCB Footprint: R0402
R126 = RES_0: RES SMD 1K OHM 1% 1/10W 0402; Part Reference: R126; Manufacturer Part Number: ERJ-2RKF1001X; Manufacturer: Panasonic; Value: 2.0k; Assy: -; PCB Footprint: R0402
R127 = R_Dup2: Part Reference: R127; DIST: FLAT; PSpiceTemplate: R^@REFDES %1 %2 ?TOLERANCE|R^@REFDES| @VALUE  ?TOLERANCE|\n.model R^@REFDES RES R=1 DEV=@TOLERANCE%|; VOLTAGE: RVMAX; SLOPE: RSMAX; MAX_TEMP: RTMAX; POWER: RMAX; COMPHEIGHT: 0.000; MEMORY: NO; COMPGROUP: 0; COMPROT: 180; COMPLOC: [970.000,1160.000]; COMPSIDE: TOP; FPLIST: AX/RC05,SM/R_0603; Value: 0.1; Assy: -; DECOUPLER: NO; COMPKEY: NO; COMPLOCKED: NO; COMPFIXED: NO; PCB Footprint: 0603
R128 = R_Dup2: Part Reference: R128; DIST: FLAT; PSpiceTemplate: R^@REFDES %1 %2 ?TOLERANCE|R^@REFDES| @VALUE  ?TOLERANCE|\n.model R^@REFDES RES R=1 DEV=@TOLERANCE%|; VOLTAGE: RVMAX; SLOPE: RSMAX; MAX_TEMP: RTMAX; POWER: RMAX; COMPHEIGHT: 0.000; MEMORY: NO; COMPGROUP: 0; COMPROT: 180; COMPLOC: [970.000,1160.000]; COMPSIDE: TOP; FPLIST: AX/RC05,SM/R_0603; Value: 0.1; Assy: -; DECOUPLER: NO; COMPKEY: NO; COMPLOCKED: NO; COMPFIXED: NO; PCB Footprint: 0603
R129 = R_Dup2: Part Reference: R129; DIST: FLAT; PSpiceTemplate: R^@REFDES %1 %2 ?TOLERANCE|R^@REFDES| @VALUE  ?TOLERANCE|\n.model R^@REFDES RES R=1 DEV=@TOLERANCE%|; VOLTAGE: RVMAX; SLOPE: RSMAX; MAX_TEMP: RTMAX; POWER: RMAX; COMPHEIGHT: 0.000; MEMORY: NO; COMPGROUP: 0; COMPROT: 180; COMPLOC: [970.000,1160.000]; COMPSIDE: TOP; FPLIST: AX/RC05,SM/R_0603; Value: 0.1; Assy: -; DECOUPLER: NO; COMPKEY: NO; COMPLOCKED: NO; COMPFIXED: NO; PCB Footprint: 0603
R130 = R_Dup2: Part Reference: R130; DIST: FLAT; PSpiceTemplate: R^@REFDES %1 %2 ?TOLERANCE|R^@REFDES| @VALUE  ?TOLERANCE|\n.model R^@REFDES RES R=1 DEV=@TOLERANCE%|; VOLTAGE: RVMAX; SLOPE: RSMAX; MAX_TEMP: RTMAX; POWER: RMAX; FPLIST: AX/RC05,SM/R_0603; COMPSIDE: TOP; COMPLOC: [970.000,1160.000]; COMPROT: 180; COMPGROUP: 0; COMPFIXED: NO; COMPHEIGHT: 0.000; Value: 0.1; Assy: -; COMPLOCKED: NO; COMPKEY: NO; DECOUPLER: NO; MEMORY: NO; PCB Footprint: 0603
R131 = R_Dup2: Part Reference: R131; DIST: FLAT; PSpiceTemplate: R^@REFDES %1 %2 ?TOLERANCE|R^@REFDES| @VALUE  ?TOLERANCE|\n.model R^@REFDES RES R=1 DEV=@TOLERANCE%|; VOLTAGE: RVMAX; SLOPE: RSMAX; MAX_TEMP: RTMAX; POWER: RMAX; FPLIST: AX/RC05,SM/R_0603; COMPSIDE: TOP; COMPLOC: [970.000,1160.000]; COMPROT: 180; COMPGROUP: 0; COMPFIXED: NO; COMPHEIGHT: 0.000; Value: 0.1; Assy: -; COMPLOCKED: NO; COMPKEY: NO; DECOUPLER: NO; MEMORY: NO; PCB Footprint: 0603
R132 = RES_0: RES SMD 4.7K OHM 5% 1/10W 0402; Part Reference: R132; Manufacturer Part Number: ERJ-2GEJ472X; MFG: Panasonic; Value: 4.7k; Assy: -; Manufacturer: Panasonic; MFG P/N: ERJ-2GEJ472X; PCB Footprint: R0402
R133 = RES_0: RES SMD 4.7K OHM 5% 1/10W 0402; Part Reference: R133; Manufacturer Part Number: ERJ-2GEJ472X; MFG: Panasonic; Value: 2.2k; Assy: -; Manufacturer: Panasonic; MFG P/N: ERJ-2GEJ472X; PCB Footprint: R0402
R134 = R_Dup2: Part Reference: R134; DIST: FLAT; PSpiceTemplate: R^@REFDES %1 %2 ?TOLERANCE|R^@REFDES| @VALUE  ?TOLERANCE|\n.model R^@REFDES RES R=1 DEV=@TOLERANCE%|; VOLTAGE: RVMAX; SLOPE: RSMAX; MAX_TEMP: RTMAX; POWER: RMAX; COMPHEIGHT: 0.000; MEMORY: NO; COMPGROUP: 0; COMPROT: 180; COMPLOC: [970.000,1160.000]; COMPSIDE: TOP; FPLIST: AX/RC05,SM/R_0603; Value: 0.1; Assy: -; DECOUPLER: NO; COMPKEY: NO; COMPLOCKED: NO; COMPFIXED: NO; PCB Footprint: 0603
R135 = R_Dup2: Part Reference: R135; DIST: FLAT; PSpiceTemplate: R^@REFDES %1 %2 ?TOLERANCE|R^@REFDES| @VALUE  ?TOLERANCE|\n.model R^@REFDES RES R=1 DEV=@TOLERANCE%|; VOLTAGE: RVMAX; SLOPE: RSMAX; MAX_TEMP: RTMAX; POWER: RMAX; COMPHEIGHT: 0.000; MEMORY: NO; COMPGROUP: 0; COMPROT: 180; COMPLOC: [970.000,1160.000]; COMPSIDE: TOP; FPLIST: AX/RC05,SM/R_0603; Value: 0.1; Assy: -; DECOUPLER: NO; COMPKEY: NO; COMPLOCKED: NO; COMPFIXED: NO; PCB Footprint: 0603
R136 = R_Dup2: Part Reference: R136; DIST: FLAT; PSpiceTemplate: R^@REFDES %1 %2 ?TOLERANCE|R^@REFDES| @VALUE  ?TOLERANCE|\n.model R^@REFDES RES R=1 DEV=@TOLERANCE%|; VOLTAGE: RVMAX; SLOPE: RSMAX; MAX_TEMP: RTMAX; POWER: RMAX; COMPHEIGHT: 0.000; MEMORY: NO; COMPGROUP: 0; COMPROT: 180; COMPLOC: [970.000,1160.000]; COMPSIDE: TOP; FPLIST: AX/RC05,SM/R_0603; Value: 0.1; Assy: -; DECOUPLER: NO; COMPKEY: NO; COMPLOCKED: NO; COMPFIXED: NO; PCB Footprint: 0603
TP_V1P0_LDO = TP_S_40_63: Square test point, 40mil inner diameter, 63mil outer diameter; Part Reference: TP_V1P0_LDO; Assy: DNI; Class: IO; Value: TP_S_40_63; PCB Footprint: tp_s_40_63
TP_V1P2 = TP_S_40_63: Square test point, 40mil inner diameter, 63mil outer diameter; Part Reference: TP_V1P2; Assy: DNI; Class: IO; Value: TP_S_40_63; PCB Footprint: tp_s_40_63
TP_V1P8 = TP_S_40_63: Square test point, 40mil inner diameter, 63mil outer diameter; Part Reference: TP_V1P8; Assy: DNI; Class: IO; Value: TP_S_40_63; PCB Footprint: tp_s_40_63
TP_V1P8_LDO = TP_S_40_63: Square test point, 40mil inner diameter, 63mil outer diameter; Part Reference: TP_V1P8_LDO; Assy: DNI; Class: IO; Value: TP_S_40_63; PCB Footprint: tp_s_40_63
TP_V2P8 = TP_S_40_63: Square test point, 40mil inner diameter, 63mil outer diameter; Part Reference: TP_V2P8; Assy: DNI; Class: IO; Value: TP_S_40_63; PCB Footprint: tp_s_40_63
TP_V3P3 = TP_S_40_63: Square test point, 40mil inner diameter, 63mil outer diameter; Part Reference: TP_V3P3; Assy: DNI; Class: IO; Value: TP_S_40_63; PCB Footprint: tp_s_40_63
TP_V5P0 = TP_S_40_63: Square test point, 40mil inner diameter, 63mil outer diameter; Part Reference: TP_V5P0; Assy: DNI; Class: IO; Value: TP_S_40_63; PCB Footprint: tp_s_40_63
TP_VCC_CORE_V1P0 = TP_S_40_63: Square test point, 40mil inner diameter, 63mil outer diameter; Part Reference: TP_VCC_CORE_V1P0; Assy: DNI; Class: IO; Value: TP_S_40_63; PCB Footprint: tp_s_40_63
TP_VCCIO0 = TP_S_40_63: Square test point, 40mil inner diameter, 63mil outer diameter; Part Reference: TP_VCCIO0; Assy: DNI; Class: IO; Value: TP_S_40_63; PCB Footprint: tp_s_40_63
TP_VCCIO1 = TP_S_40_63: Square test point, 40mil inner diameter, 63mil outer diameter; Part Reference: TP_VCCIO1; Assy: DNI; Class: IO; Value: TP_S_40_63; PCB Footprint: tp_s_40_63
TP_VCCIO2 = TP_S_40_63: Square test point, 40mil inner diameter, 63mil outer diameter; Part Reference: TP_VCCIO2; Assy: DNI; Class: IO; Value: TP_S_40_63; PCB Footprint: tp_s_40_63
TP_VCCIO3 = TP_S_40_63: Square test point, 40mil inner diameter, 63mil outer diameter; Part Reference: TP_VCCIO3; Assy: DNI; Class: IO; Value: TP_S_40_63; PCB Footprint: tp_s_40_63
TP_VCCIO4 = TP_S_40_63: Square test point, 40mil inner diameter, 63mil outer diameter; Part Reference: TP_VCCIO4; Assy: DNI; Class: IO; Value: TP_S_40_63; PCB Footprint: tp_s_40_63
TP_VCCIO5 = TP_S_40_63: Square test point, 40mil inner diameter, 63mil outer diameter; Part Reference: TP_VCCIO5; Assy: DNI; Class: IO; Value: TP_S_40_63; PCB Footprint: tp_s_40_63
TP_VCCIO6 = TP_S_40_63: Square test point, 40mil inner diameter, 63mil outer diameter; Part Reference: TP_VCCIO6; Assy: DNI; Class: IO; Value: TP_S_40_63; PCB Footprint: tp_s_40_63
TP_VCCIO7 = TP_S_40_63: Square test point, 40mil inner diameter, 63mil outer diameter; Part Reference: TP_VCCIO7; Assy: DNI; Class: IO; Value: TP_S_40_63; PCB Footprint: tp_s_40_63
U11 = NCP110AMX120TBG: Part Reference: U11; Value: NCP110AMX120TBG; Assy: -; PCB Footprint: 4XDFN_NCP110
U12 = NCP110AMX280TBG: Part Reference: U12; Value: NCP110AMX280TBG; Assy: -; PCB Footprint: 4XDFN_NCP110

## Sheet 03- Power Decoupling.SchDoc: Power Decoupling
size A3; Page Number: 3; Page Size: B; Page Count: 12; Board Rev: B; Project Name: CrossLink-NX Evaluation Board; RevCode: 1.0; Doc: 305-PD-19-0819; DsnPath: C:\Users\HAltinkilit\Downloads\Crosslink-NX-Design-Files\CrossLink-NX-Eval-Brd-Schematic-RevB-191122.DSN; SchematicName: SCHEMATIC1; PageName: 12 - Power Decoupling; PageSize: B; TopSchematic: True
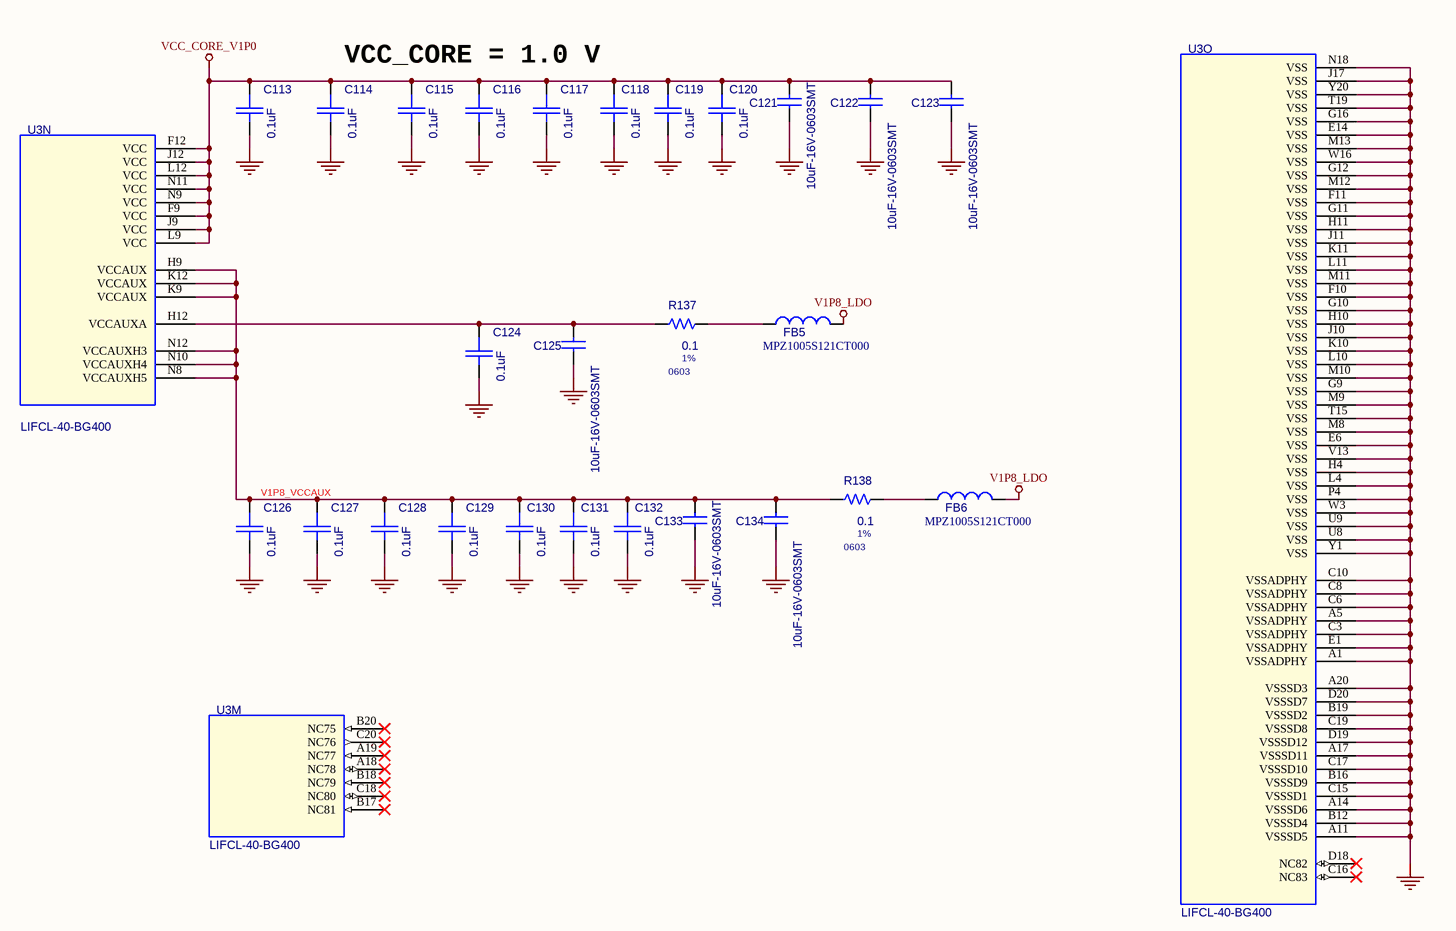
[diagram p2: 03- Power Decoupling.SchDoc]

### Parts
C113  0.1uF  [C0201]
C114  0.1uF  [C0201]
C115  0.1uF  [C0201]
C116  0.1uF  [C0201]
C117  0.1uF  [C0201]
C118  0.1uF  [C0201]
C119  0.1uF  [C0201]
C120  0.1uF  [C0201]
C121  10uF-16V-0603SMT  [C0603]
C122  10uF-16V-0603SMT  [C0603]
C123  10uF-16V-0603SMT  [C0603]
C124  0.1uF  [C0201]
C125  10uF-16V-0603SMT  [C0603]
C126  0.1uF  [C0201]
C127  0.1uF  [C0201]
C128  0.1uF  [C0201]
C129  0.1uF  [C0201]
C130  0.1uF  [C0201]
C131  0.1uF  [C0201]
C132  0.1uF  [C0201]
C133  10uF-16V-0603SMT  [C0603]
C134  10uF-16V-0603SMT  [C0603]
FB5  MPZ1005S121CT000  [FB0402]
FB6  MPZ1005S121CT000  [FB0402]
R137  0.1  Tollerance: 1%  [0603]
R138  0.1  Tollerance: 1%  [0603]
U3  LIFCL-40-BG400  [LIFCL-40-BG400]  (parts M,N,O of 15)

### Nets
GND: C113.2 C114.2 C115.2 C116.2 C117.2 C118.2 C119.2 C120.2 C121.1 C122.1 C123.1 C124.2 C125.1 C126.2 C127.2 C128.2 C129.2 C130.2 C131.2 C132.2 C133.1 C134.1 U3.A1(VSSADPHY) U3.A5(VSSADPHY) U3.A11(VSSSD5) U3.A14(VSSSD6) U3.A17(VSSSD11) U3.A20(VSSSD3) U3.B12(VSSSD4) U3.B16(VSSSD9) U3.B19(VSSSD2) U3.C3(VSSADPHY) U3.C6(VSSADPHY) U3.C8(VSSADPHY) U3.C10(VSSADPHY) U3.C15(VSSSD1) U3.C17(VSSSD10) U3.C19(VSSSD8) U3.D19(VSSSD12) U3.D20(VSSSD7) U3.E1(VSSADPHY) U3.E6(VSS) U3.E14(VSS) U3.F10(VSS) U3.F11(VSS) U3.G9(VSS) U3.G10(VSS) U3.G11(VSS) U3.G12(VSS) U3.G16(VSS) U3.H4(VSS) U3.H10(VSS) U3.H11(VSS) U3.J10(VSS) U3.J11(VSS) U3.J17(VSS) U3.K10(VSS) U3.K11(VSS) U3.L4(VSS) U3.L10(VSS) U3.L11(VSS) U3.M8(VSS) U3.M9(VSS) U3.M10(VSS) U3.M11(VSS) U3.M12(VSS) U3.M13(VSS) U3.N18(VSS) U3.P4(VSS) U3.T15(VSS) U3.T19(VSS) U3.U8(VSS) U3.U9(VSS) U3.V13(VSS) U3.W3(VSS) U3.W16(VSS) U3.Y1(VSS) U3.Y20(VSS)
V1P8_LDO: FB5.2 FB6.2
VCC_CORE_V1P0: C113.1 C114.1 C115.1 C116.1 C117.1 C118.1 C119.1 C120.1 C121.2 C122.2 C123.2 U3.F9(VCC) U3.F12(VCC) U3.J9(VCC) U3.J12(VCC) U3.L9(VCC) U3.L12(VCC) U3.N9(VCC) U3.N11(VCC)
V1P8_VCCAUX: C126.1 C127.1 C128.1 C129.1 C130.1 C131.1 C132.1 C133.2 C134.2 R138.1 U3.H9(VCCAUX) U3.K9(VCCAUX) U3.K12(VCCAUX) U3.N8(VCCAUXH5) U3.N10(VCCAUXH4) U3.N12(VCCAUXH3)
NetC124_1: C124.1 C125.2 R137.1 U3.H12(VCCAUXA)
NetFB5_1: FB5.1 R137.2
NetFB6_1: FB6.1 R138.2

Not connected (* = marked no-connect by the designer): U3 A18(NC78)* A19(NC77)* B17(NC81)* B18(NC79)* B20(NC75)* C16(NC83)* C18(NC80)* C20(NC76)* D18(NC82)*

### Notes on the sheet
- VCC_CORE = 1.0 V
- Proje/Project:
- Sayfa Adı/Document Name:
- Çizilme Tarihi/Drawing Date
- Umit KAYACIK
- Tasarlayan/Designed By
- Sayfa/Sheet:
- Revision:
- of
- Son Güncelleme/Last Edit Date
- Kontrol eden/Checked By
- Onaylayan/Approved By
- Boyut/Size:
- Varyant/Variant:
- Dil/Language:
- A3
- ENG

### Library data of the parts
C113 = CAP_1: CAP CER 0.1UF 25V 10% X5R 0201; Part Reference: C113; Manufacturer: Murata; Manufacturer Part Number: GRM033R61E104KE14J; Value: 0.1uF; Assy: -; PCB Footprint: C0201
C114 = CAP_1: CAP CER 0.1UF 25V 10% X5R 0201; Part Reference: C114; Manufacturer: Murata; Manufacturer Part Number: GRM033R61E104KE14J; Value: 0.1uF; Assy: -; PCB Footprint: C0201
C115 = CAP_1: CAP CER 0.1UF 25V 10% X5R 0201; Part Reference: C115; Manufacturer: Murata; Manufacturer Part Number: GRM033R61E104KE14J; Value: 0.1uF; Assy: -; PCB Footprint: C0201
C116 = CAP_1: CAP CER 0.1UF 25V 10% X5R 0201; Part Reference: C116; Manufacturer: Murata; Manufacturer Part Number: GRM033R61E104KE14J; Value: 0.1uF; Assy: -; PCB Footprint: C0201
C117 = CAP_1: CAP CER 0.1UF 25V 10% X5R 0201; Part Reference: C117; Manufacturer: Murata; Manufacturer Part Number: GRM033R61E104KE14J; Value: 0.1uF; Assy: -; PCB Footprint: C0201
C118 = CAP_SMT_0805: CAP CER 0.1UF 25V 10% X5R 0201; Part Reference: C118; Manufacturer: Murata; Manufacturer Part Number: GRM033R61E104KE14J; Value: 0.1uF; Assy: -; PCB Footprint: C0201
C119 = CAP_SMT_0805: CAP CER 0.1UF 25V 10% X5R 0201; Part Reference: C119; Manufacturer: Murata; Manufacturer Part Number: GRM033R61E104KE14J; Value: 0.1uF; Assy: -; PCB Footprint: C0201
C120 = CAP_SMT_0805: CAP CER 0.1UF 25V 10% X5R 0201; Part Reference: C120; Manufacturer: Murata; Manufacturer Part Number: GRM033R61E104KE14J; Value: 0.1uF; Assy: -; PCB Footprint: C0201
C121 = CAP NP_Dup1: Part Reference: C121; FPLIST: SM/C_0402; COMPSIDE: TOP; COMPLOC: [1820.000,2015.000]; COMPROT: 270; COMPGROUP: 0; COMPFIXED: NO; COMPHEIGHT: 0.000; Value: 10uF-16V-0603SMT; Assy: -; COMPLOCKED: NO; COMPKEY: NO; DECOUPLER: NO; MEMORY: NO; PCB Footprint: C0603
C122 = CAP NP_Dup1: Part Reference: C122; FPLIST: SM/C_0402; COMPSIDE: TOP; COMPLOC: [1820.000,2015.000]; COMPROT: 270; COMPGROUP: 0; COMPFIXED: NO; COMPHEIGHT: 0.000; Value: 10uF-16V-0603SMT; Assy: -; COMPLOCKED: NO; COMPKEY: NO; DECOUPLER: NO; MEMORY: NO; PCB Footprint: C0603
C123 = CAP NP_Dup1: Part Reference: C123; FPLIST: SM/C_0402; COMPSIDE: TOP; COMPLOC: [1820.000,2015.000]; COMPROT: 270; COMPGROUP: 0; COMPFIXED: NO; COMPHEIGHT: 0.000; Value: 10uF-16V-0603SMT; Assy: -; COMPLOCKED: NO; COMPKEY: NO; DECOUPLER: NO; MEMORY: NO; PCB Footprint: C0603
C124 = CAP_1: CAP CER 0.1UF 25V 10% X5R 0201; Part Reference: C124; Manufacturer: Murata; Manufacturer Part Number: GRM033R61E104KE14J; Value: 0.1uF; Assy: -; PCB Footprint: C0201
C125 = CAP NP_Dup1: Part Reference: C125; COMPHEIGHT: 0.000; MEMORY: NO; COMPGROUP: 0; COMPROT: 270; COMPLOC: [1820.000,2015.000]; COMPSIDE: TOP; FPLIST: SM/C_0402; Value: 10uF-16V-0603SMT; Assy: -; DECOUPLER: NO; COMPKEY: NO; COMPLOCKED: NO; COMPFIXED: NO; PCB Footprint: C0603
C126 = CAP_1: CAP CER 0.1UF 25V 10% X5R 0201; Part Reference: C126; Manufacturer: Murata; Manufacturer Part Number: GRM033R61E104KE14J; Value: 0.1uF; Assy: -; PCB Footprint: C0201
C127 = CAP_1: CAP CER 0.1UF 25V 10% X5R 0201; Part Reference: C127; Manufacturer: Murata; Manufacturer Part Number: GRM033R61E104KE14J; Value: 0.1uF; Assy: -; PCB Footprint: C0201
C128 = CAP_1: CAP CER 0.1UF 25V 10% X5R 0201; Part Reference: C128; Manufacturer Part Number: GRM033R61E104KE14J; Manufacturer: Murata; Value: 0.1uF; Assy: -; PCB Footprint: C0201
C129 = CAP_1: CAP CER 0.1UF 25V 10% X5R 0201; Part Reference: C129; Manufacturer: Murata; Manufacturer Part Number: GRM033R61E104KE14J; Value: 0.1uF; Assy: -; PCB Footprint: C0201
C130 = CAP_SMT_0805: CAP CER 0.1UF 25V 10% X5R 0201; Part Reference: C130; Manufacturer: Murata; Manufacturer Part Number: GRM033R61E104KE14J; Value: 0.1uF; Assy: -; PCB Footprint: C0201
C131 = CAP_SMT_0805: CAP CER 0.1UF 25V 10% X5R 0201; Part Reference: C131; Manufacturer: Murata; Manufacturer Part Number: GRM033R61E104KE14J; Value: 0.1uF; Assy: -; PCB Footprint: C0201
C132 = CAP_SMT_0805: CAP CER 0.1UF 25V 10% X5R 0201; Part Reference: C132; Manufacturer: Murata; Manufacturer Part Number: GRM033R61E104KE14J; Value: 0.1uF; Assy: -; PCB Footprint: C0201
C133 = CAP NP_Dup1: Part Reference: C133; COMPHEIGHT: 0.000; MEMORY: NO; COMPGROUP: 0; COMPROT: 270; COMPLOC: [1820.000,2015.000]; COMPSIDE: TOP; FPLIST: SM/C_0402; Value: 10uF-16V-0603SMT; Assy: -; DECOUPLER: NO; COMPKEY: NO; COMPLOCKED: NO; COMPFIXED: NO; PCB Footprint: C0603
C134 = CAP NP_Dup1: Part Reference: C134; COMPHEIGHT: 0.000; MEMORY: NO; COMPGROUP: 0; COMPROT: 270; COMPLOC: [1820.000,2015.000]; COMPSIDE: TOP; FPLIST: SM/C_0402; Value: 10uF-16V-0603SMT; Assy: -; DECOUPLER: NO; COMPKEY: NO; COMPLOCKED: NO; COMPFIXED: NO; PCB Footprint: C0603
FB5 = INDUCTOR_0: FERRITE BEAD 120 OHM 0402 1LN; Part Reference: FB5; Manufacturer: TDK Corporation; Value: MPZ1005S121CT000; Assy: -; PCB Footprint: FB0402; Manufacturer Part Number: MPZ1005S121CT000
FB6 = INDUCTOR_0: FERRITE BEAD 120 OHM 0402 1LN; Part Reference: FB6; Manufacturer: TDK Corporation; Value: MPZ1005S121CT000; Assy: -; PCB Footprint: FB0402; Manufacturer Part Number: MPZ1005S121CT000
R137 = R_Dup2: Part Reference: R137; DIST: FLAT; PSpiceTemplate: R^@REFDES %1 %2 ?TOLERANCE|R^@REFDES| @VALUE  ?TOLERANCE|\n.model R^@REFDES RES R=1 DEV=@TOLERANCE%|; VOLTAGE: RVMAX; SLOPE: RSMAX; MAX_TEMP: RTMAX; POWER: RMAX; FPLIST: AX/RC05,SM/R_0603; COMPSIDE: TOP; COMPLOC: [970.000,1160.000]; COMPROT: 180; COMPGROUP: 0; COMPFIXED: NO; COMPHEIGHT: 0.000; Value: 0.1; Assy: -; COMPLOCKED: NO; COMPKEY: NO; DECOUPLER: NO; MEMORY: NO; PCB Footprint: 0603
R138 = R_Dup2: Part Reference: R138; DIST: FLAT; PSpiceTemplate: R^@REFDES %1 %2 ?TOLERANCE|R^@REFDES| @VALUE  ?TOLERANCE|\n.model R^@REFDES RES R=1 DEV=@TOLERANCE%|; VOLTAGE: RVMAX; SLOPE: RSMAX; MAX_TEMP: RTMAX; POWER: RMAX; FPLIST: AX/RC05,SM/R_0603; COMPSIDE: TOP; COMPLOC: [970.000,1160.000]; COMPROT: 180; COMPGROUP: 0; COMPFIXED: NO; COMPHEIGHT: 0.000; Value: 0.1; Assy: -; COMPLOCKED: NO; COMPKEY: NO; DECOUPLER: NO; MEMORY: NO; PCB Footprint: 0603
U3 = LIFCL-40-BG400: Part Reference: U3; Source Part: LIFCL-40-BG400A.Normal; SWAP_INFO: (S1+S2+S3+S4+S5+S6+S7+S8+S9+S10+S11+S12+S13+S14+S15); SPLIT_INST: TRUE; Name: I17266603; Primitive: DEFAULT; Implementation Type: <none>; Location X-Coordinate: 0; Source Library: C:\USERS\SLIU1\DOCUMENTS\PCB_DESIGN\JEDI_EVAL_BOARD\SCHEMATIC\LIFCL40.OLB; Power Pins Visible: False; Value: LIFCL-40-BG400; Location Y-Coordinate: 0; Color: Default; Source Package: LIFCL-40-BG400; Graphic: LIFCL-40-BG400A.Normal; Assy: -; PCB Footprint: LIFCL-40-BG400